# EAGLE schematic TSAL_ON_BRIAN_BOARD (EAGLE 6.5.0)
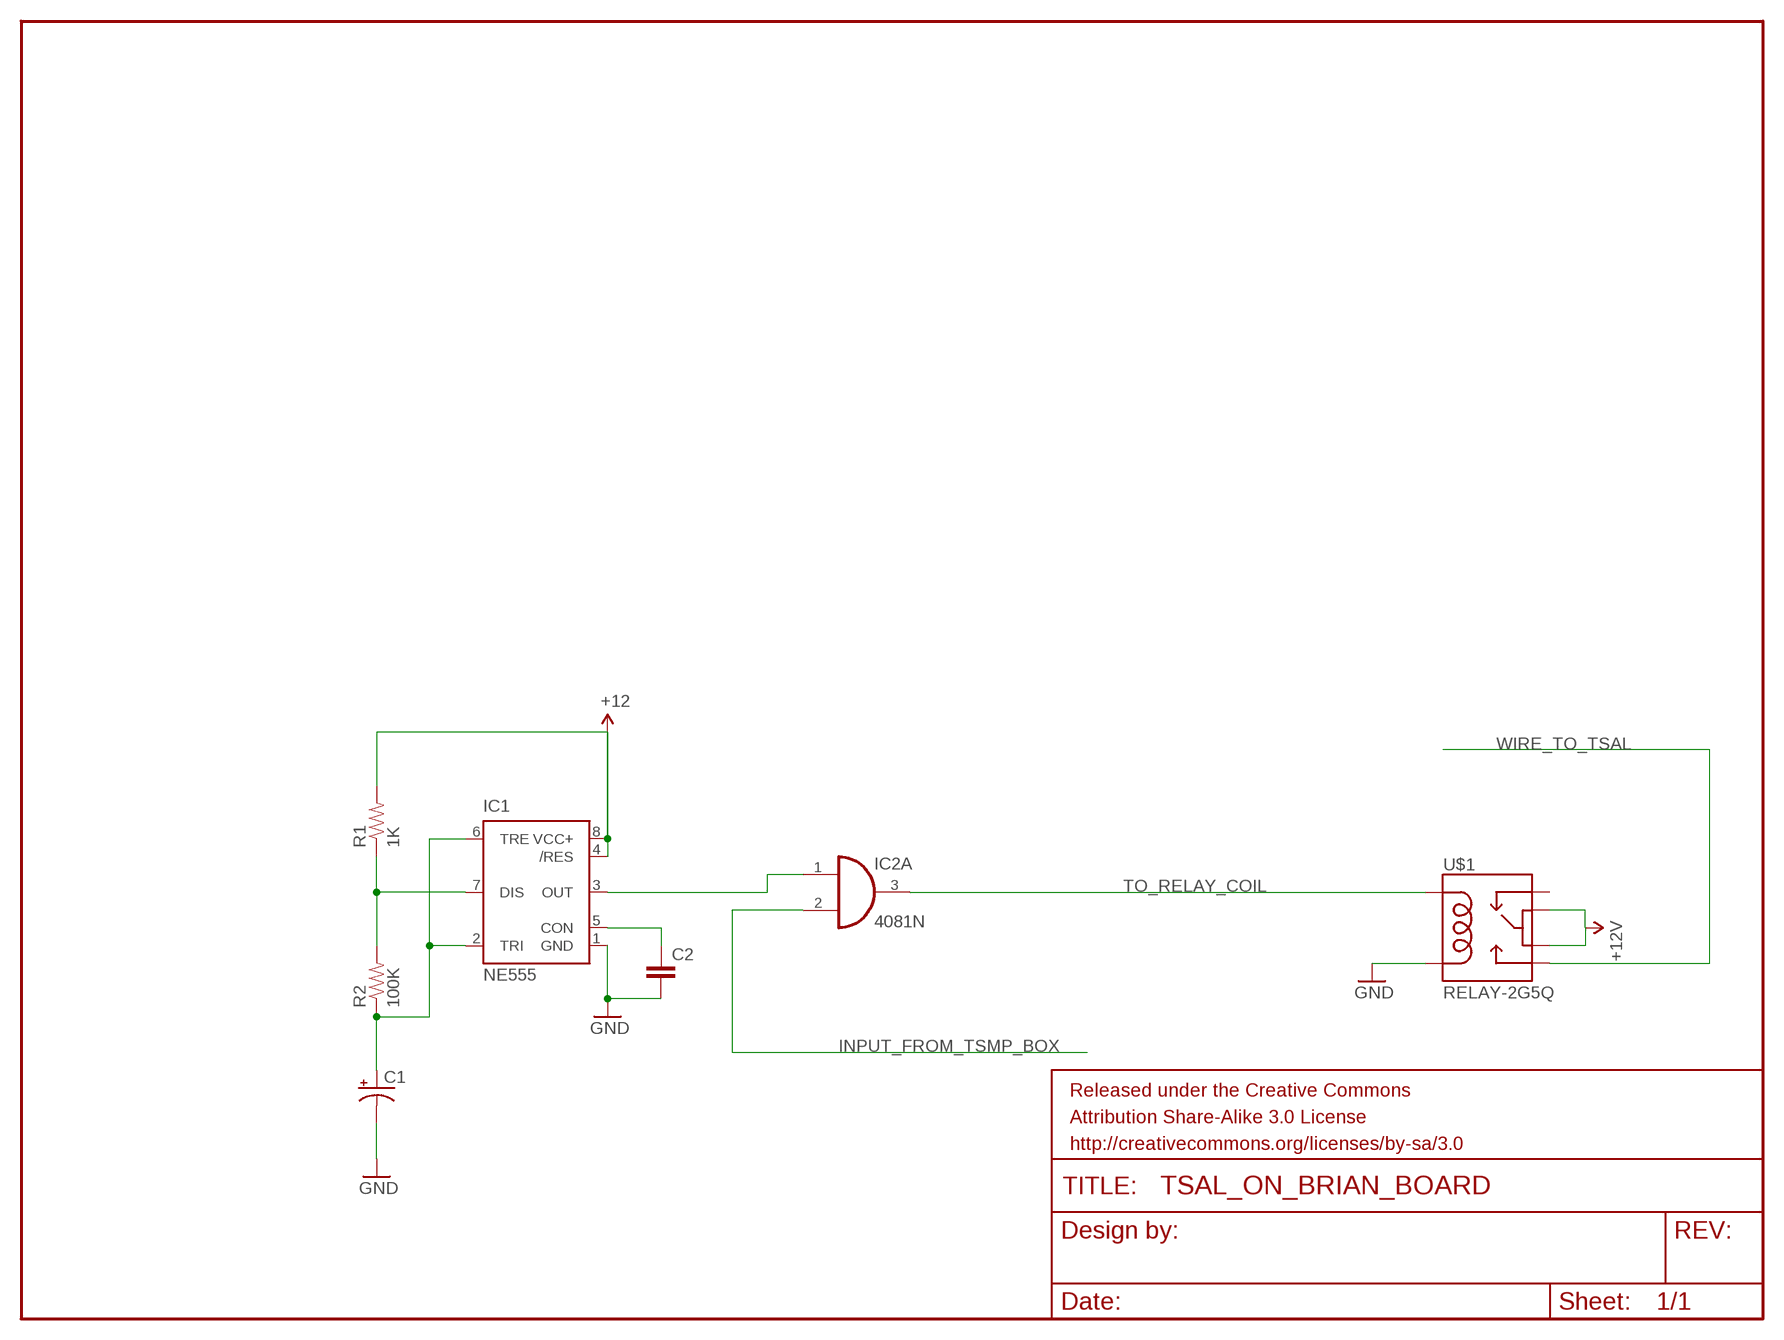
[diagram p0: schematic, sheet 1]

## Parts
C1  CAP_POLPTH1  [CPOL-RADIAL-100UF-25V]
C2  CAPPTH2  [CAP-PTH-SMALL2]
FRAME1  FRAME-LETTER  [CREATIVE_COMMONS]
IC1  NE555  [DIL-08]
IC2  4081N  [DIL14]
R1  1K  RESISTOREZ  [AXIAL-0.3EZ]
R2  100K  RESISTOREZ  [AXIAL-0.3EZ]
U$1  RELAY-2G5Q  [RELAY-G5V]

## Nets
+12V: IC1.4(/RES) IC1.8(VCC+) R1.P$2 U$1.5 U$1.6 ; supply symbol labelled +12
GND: C1.2(-) C2.2 IC1.1(GND) U$1.9
INPUT_FROM_TSMP_BOX: IC2.2(A:I1)
N$1: IC1.3(OUT) IC2.1(A:I0)
N$2: IC1.7(DIS) R1.P$1 R2.P$2
N$3: C1.1(+) IC1.2(TRI) IC1.6(TRE) R2.P$1
N$5: C2.1 IC1.5(CON)
TO_RELAY_COIL: IC2.3(A:O) U$1.2
WIRE_TO_TSAL: U$1.10
Unconnected: IC2.4(B:O) IC2.5(B:I0) IC2.6(B:I1) IC2.8(C:I0) IC2.9(C:I1) IC2.10(C:O) IC2.11(D:O) IC2.12(D:I0) IC2.13(D:I1) U$1.1

## Power pins joined to a net without a drawn wire
VDD: IC2.14(P:VDD)
VSS: IC2.7(P:VSS)

## Library data of the parts
C1 = SparkFun-Capacitors:CAP_POL: Capacitor Polarized These are standard SMD and PTH capacitors. Normally 10uF, 47uF, and 100uF in electrolytic and tantalum varieties. Always verify the external diameter of the through hole cap, it varies with capacity, voltage, and manufacturer. The EIA devices should be standard.
C2 = SparkFun-Passives:CAP: Capacitor Standard 0603 ceramic capacitor, and 0.1" leaded capacitor.
FRAME1 = SparkFun-Aesthetics:FRAME-LETTER: Schematic Frame Standard 8.5x11 US Letter frame
IC1 = st-microelectronics:NE555: General purpose bipolar Timer; MF: Arrow Electronics; MPN: NE555N; OC_FARNELL: 1467742; OC_NEWARK: 89K1486
IC2 = 40xx:4081: Quad 2-input AND
R1 R2 = SparkFun-Passives:RESISTOR: Resistor Basic schematic elements and footprints for 0603, 1206, and PTH resistors.
U$1 = SparkFun-Electromechanical:RELAY-2: SPDT relay (COM-00100)